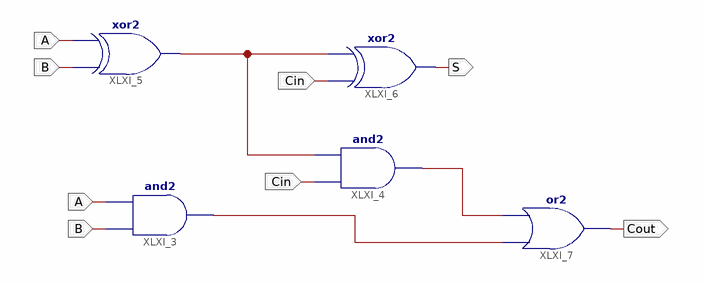
[diagram p0: schematic sheet 1]
// Xilinx ISE schematic full_adder.sch (artix7) as structural Verilog: 5 symbols, 5 ports
module full_adder (
  input  A,
  input  B,
  input  Cin,
  output S,
  output Cout
);

  wire XLXN_10, XLXN_11, XLXN_12;

  and XLXI_3 (XLXN_10, B, A);
  and XLXI_4 (XLXN_11, Cin, XLXN_12);
  xor XLXI_5 (XLXN_12, B, A);
  xor XLXI_6 (S, Cin, XLXN_12);
  or XLXI_7 (Cout, XLXN_10, XLXN_11);
endmodule
